# Altium schematic sheet 2_主控.SchDoc
size A3
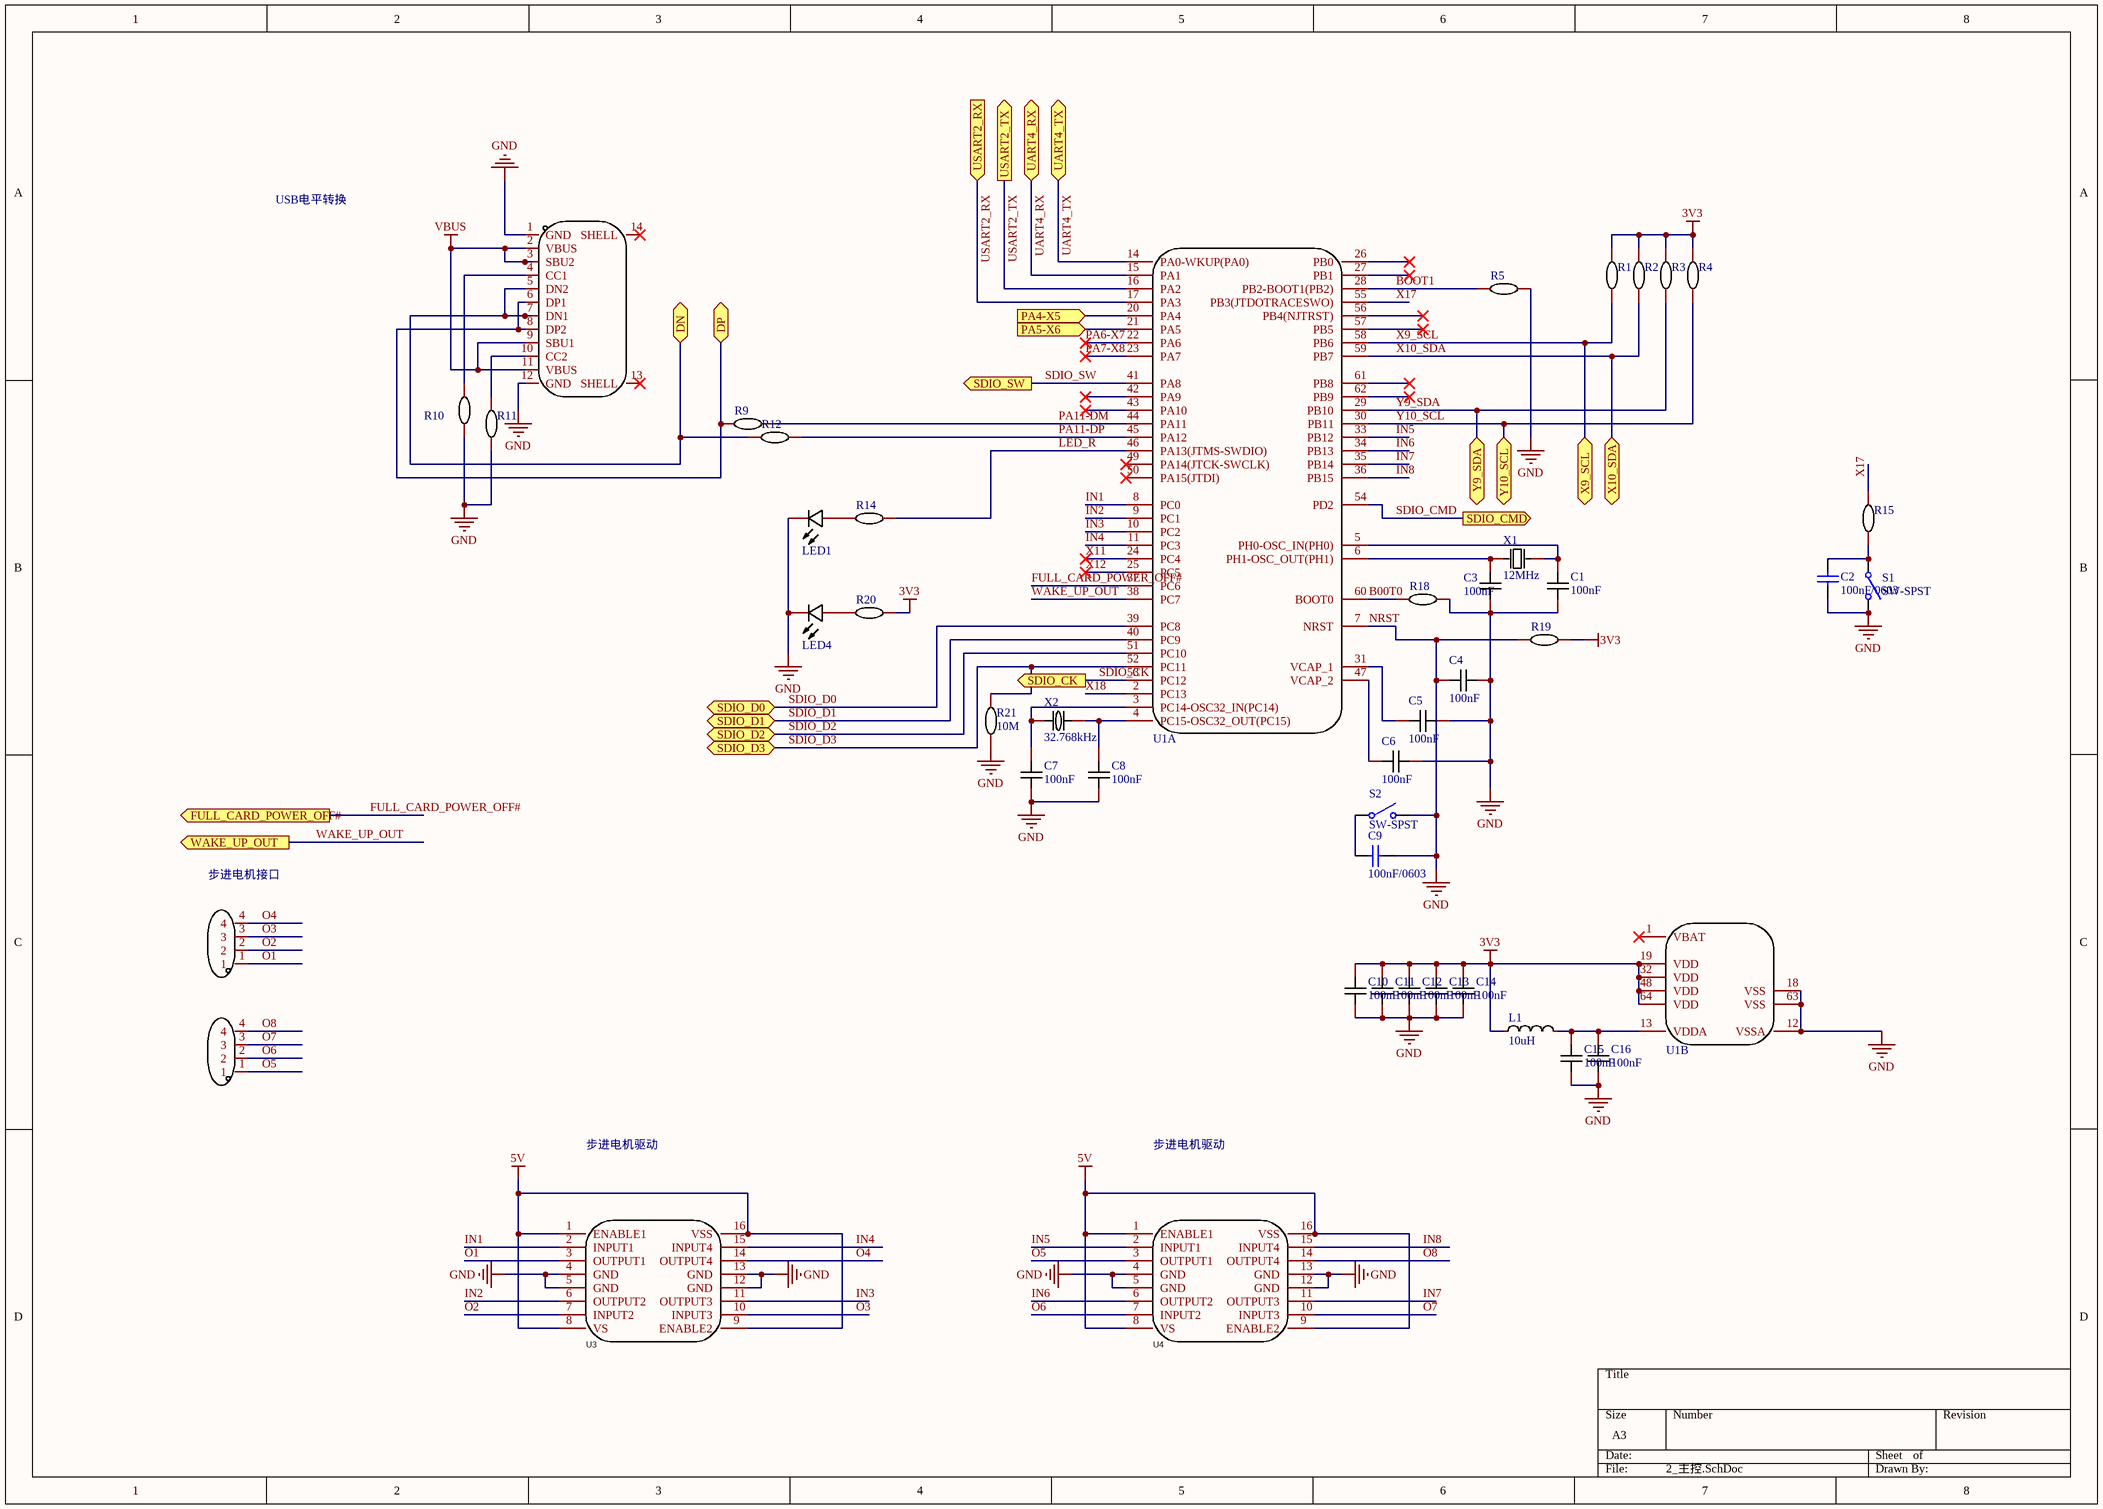
[diagram p0: 2_主控.SchDoc]

## Parts
C1  100nF  [0603C]
C2  100nF/0603  [0603C]
C3  100nF  [0603C]
C4  100nF  [0603C]
C5  100nF  [0603C]
C6  100nF  [0603C]
C7  100nF  [0603C]
C8  100nF  [0603C]
C9  100nF/0603  [0603C]
C10  100nF  [0402C]
C11  100nF  [0402C]
C12  100nF  [0402C]
C13  100nF  [0402C]
C14  100nF  [0402C]
C15  100nF  [0402C]
C16  100nF  [0402C]
CN1  HC-XHB-4A  [CONN-TH_4P-P2.50_HCTL_HC-XHB-4A]  (value not drawn)
CN2  HC-XHB-4A  [CONN-TH_4P-P2.50_HCTL_HC-XHB-4A]  (value not drawn)
L1  10uH  [L0603]
LED1  19-217/BHC-ZL1M2RY/3T  [LED0603-R-RD]  (value not drawn)
LED4  19-217/BHC-ZL1M2RY/3T  [LED0603-R-RD]  (value not drawn)
R1  (no value)  [0402R]
R2  (no value)  [0402R]
R3  (no value)  [0402R]
R4  (no value)  [0402R]
R5  (no value)  [0402R]
R9  (no value)  [0402R]
R10  (no value)  [0402R]
R11  (no value)  [0402R]
R12  (no value)  [0402R]
R14  (no value)  [0402R]
R15  (no value)  [0402R]
R18  (no value)  [0402R]
R19  (no value)  [0402R]
R20  (no value)  [0402R]
R21  10M  [0603R]
S1  SW-SPST  [SW-3x6mm-SMT]
S2  SW-SPST  [SW-3x6mm-SMT]
U1  STM32F405RGT6  [LQFP-64_L10.0-W10.0-P0.50-LS12.0-BL]  (value not drawn)  (parts A,B of 2)
U3  L293D  [SOIC-20_L13.0-W7.6-P1.27-LS10.3-BL]  (value not drawn)
U4  L293D  [SOIC-20_L13.0-W7.6-P1.27-LS10.3-BL]  (value not drawn)
USB1  TYPE-C 16PIN 2MD(073)  [USB-C-SMD_TYPE-C-6PIN-2MD-073]  (value not drawn)
X1  12MHz  [CRYSTAL-SMD_L5.0-W3.2]
X2  32.768kHz  [FC-135R_L3.2-W1.5]

## Ports
DN (bidir), DP (bidir), FULL_CARD_POWER_OFF# (out), PA4-X5 (in), PA5-X6 (in), SDIO_CK (out), SDIO_CMD (out), SDIO_D0 (bidir), SDIO_D1 (bidir), SDIO_D2 (bidir), SDIO_D3 (bidir), SDIO_SW (out), UART4_RX (bidir), UART4_TX (bidir), USART2_RX (in), USART2_TX (out), WAKE_UP_OUT (out), X9_SCL (bidir), X10_SDA (bidir), Y9_SDA (bidir), Y10_SCL (bidir)

## Nets
3V3: C10.2 C11.2 C12.2 C13.2 C14.2 L1.1 R1.2 R2.2 R3.2 R4.2 R19.1 R20.1 U1.19(VDD) U1.32(VDD) U1.48(VDD) U1.64(VDD)
5V: U3.1(ENABLE1) U3.8(VS) U3.9(ENABLE2) U3.16(VSS) U4.1(ENABLE1) U4.8(VS) U4.9(ENABLE2) U4.16(VSS)
NRST: C1.1 C2.2 C3.1 C4.1 C4.2 C5.1 C6.1 C7.1 C8.1 C9.2 C10.1 C11.1 C12.1 C13.1 C14.1 C15.1 C16.1 LED1.2(C) LED4.2(C) R5.2 R10.1 R11.1 R18.1 R19.2 R21.1 S1.2(NO) S2.2(NO) U1.7(NRST) U1.12(VSSA) U1.18(VSS) U1.63(VSS) U3.4(GND) U3.5(GND) U3.12(GND) U3.13(GND) U4.4(GND) U4.5(GND) U4.12(GND) U4.13(GND) USB1.1(GND) USB1.12(GND)  [also labelled GND]
VBUS: USB1.2(VBUS) USB1.3(SBU2) USB1.9(SBU1) USB1.11(VBUS)
B00T0: R18.2 U1.60(BOOT0)
BOOT1: R5.1 U1.28(PB2-BOOT1(PB2))
DN: R12.2 USB1.5(DN2) USB1.7(DN1) ; port DN
DP: R9.2 USB1.6(DP1) USB1.8(DP2) ; port DP
FULL_CARD_POWER_OFF#: U1.37(PC6) ; port FULL_CARD_POWER_OFF#
IN1: U1.8(PC0) U3.2(INPUT1)
IN2: U1.9(PC1) U3.6(OUTPUT2)
IN3: U1.10(PC2) U3.11(OUTPUT3)
IN4: U1.11(PC3) U3.15(INPUT4)
IN5: U1.33(PB12) U4.2(INPUT1)
IN6: U1.34(PB13) U4.6(OUTPUT2)
IN7: U1.35(PB14) U4.11(OUTPUT3)
IN8: U1.36(PB15) U4.15(INPUT4)
LED_R: R14.2 U1.46(PA13(JTMS-SWDIO))
O1: CN1.1 U3.3(OUTPUT1)
O2: CN1.2 U3.7(INPUT2)
O3: CN1.3 U3.10(INPUT3)
O4: CN1.4 U3.14(OUTPUT4)
O5: CN2.1 U4.3(OUTPUT1)
O6: CN2.2 U4.7(INPUT2)
O7: CN2.3 U4.10(INPUT3)
O8: CN2.4 U4.14(OUTPUT4)
PA4-X5: U1.20(PA4) ; port PA4-X5
PA5-X6: U1.21(PA5) ; port PA5-X6
PA6-X7: U1.22(PA6)
PA7-X8: U1.23(PA7)
PA11-DM: R9.1 U1.44(PA11)
PA11-DP: R12.1 U1.45(PA12)
SDIO_CK: U1.53(PC12) ; port SDIO_CK
SDIO_CMD: U1.54(PD2) ; port SDIO_CMD
SDIO_D0: U1.39(PC8) ; port SDIO_D0
SDIO_D1: U1.40(PC9) ; port SDIO_D1
SDIO_D2: U1.51(PC10) ; port SDIO_D2
SDIO_D3: R21.2 U1.52(PC11) ; port SDIO_D3
SDIO_SW: U1.41(PA8) ; port SDIO_SW
UART4_RX: U1.15(PA1) ; port UART4_RX
UART4_TX: U1.14(PA0-WKUP(PA0)) ; port UART4_TX
USART2_RX: U1.17(PA3) ; port USART2_RX
USART2_TX: U1.16(PA2) ; port USART2_TX
WAKE_UP_OUT: U1.38(PC7) ; port WAKE_UP_OUT
X9_SCL: R1.1 U1.58(PB6) ; port X9_SCL
X10_SDA: R2.1 U1.59(PB7) ; port X10_SDA
X11: U1.24(PC4)
X12: U1.25(PC5)
X17: R15.2 U1.55(PB3(JTDOTRACESWO))
X18: U1.2(PC13)
Y9_SDA: R3.1 U1.29(PB10) ; port Y9_SDA
Y10_SCL: R4.1 U1.30(PB11) ; port Y10_SCL
NetC1_2: C1.2 U1.5(PH0-OSC_IN(PH0)) X1.2(OSC2)
NetC2_1: C2.1 R15.1 S1.1(COMMON)
NetC3_2: C3.2 U1.6(PH1-OSC_OUT(PH1)) X1.1(OSC1)
NetC5_2: C5.2 U1.31(VCAP_1)
NetC6_2: C6.2 U1.47(VCAP_2)
NetC7_2: C7.2 U1.3(PC14-OSC32_IN(PC14)) X2.1
NetC8_2: C8.2 U1.4(PC15-OSC32_OUT(PC15)) X2.2
NetC9_1: C9.1 S2.1(COMMON)
NetC15_2: C15.2 C16.2 L1.2 U1.13(VDDA)
NetLED1_1: LED1.1(A) R14.1
NetLED4_1: LED4.1(A) R20.2
NetR10_2: R10.2 USB1.4(CC1)
NetR11_2: R11.2 USB1.10(CC2)

Not connected (* = marked no-connect by the designer): U1 1(VBAT)* 26(PB0)* 27(PB1)* 42(PA9)* 43(PA10)* 49(PA14(JTCK-SWCLK))* 50(PA15(JTDI))* 56(PB4(NJTRST))* 57(PB5)* 61(PB8)* 62(PB9)*; USB1 13(SHELL)* 14(SHELL)*

## Notes on the sheet
- USB电平转换
- (near CN1) 步进电机接口
- 步进电机驱动

## Library data of the parts
C1 C3-C8 C10-C16 = CAP_0603: Symbol: CapAcitance; Convert to PCB: yes; Device: CAP_0603; Add into BOM: yes; Supplier Footprint: 0603; Value: 100nF; Name: 100nF
C2 C9 = Cap: Capacitor; Value: 100pF; Published: 8-Jun-2000; LatestRevisionDate: 17-Jul-2002; LatestRevisionNote: Re-released for DXP Platform.; PackageReference: RAD-0.3; Publisher: Altium Limited; PackageDescription: Radial Cap, Thru-Hole; 2 Leads; 0.3 in Pin Spacing
CN1 CN2 = HC-XHB-4A: Add into BOM: yes; Pins Structure: 1x4P; Pitch: 2.5mm; Number of PINs Per Row: 4; Current Rating (Max): 3A; Symbol: HC-XHB-4A; Device: HC-XHB-4A; Supplier: LCSC; Supplier Part: C2845492; Manufacturer Part: HC-XHB-4A; JLCPCB Part Class: Extended Part; Datasheet: https://atta.szlcsc.com/upload/public/pdf/source/20230711/94C5BFB4D0A0F292EDF07DDE5BFB6378.pdf; Convert to PCB: yes; Row Spacing: -; Number of Pins: 4P; Number of Rows: 1; Reference Series: -
L1 = L_0603: Symbol: SDFL1608S100KTF; Add into BOM: yes; Device: L_0603; Supplier Footprint: L0603; Convert to PCB: yes; Value: 10uH; Name: 10uH
LED1 LED4 = 19-217/BHC-ZL1M2RY/3T: Add into BOM: yes; Luminous Intensity (IF=20mA): 11.5~28.5mcd@5mA; Dominant Wavelength / Coordinate rank: 465~475nm; Symbol: 19-217/BHC-ZL1M2RY/3T; Device: 19-217/BHC-ZL1M2RY/3T; Supplier Part: C72041; Manufacturer Part: 19-217/BHC-ZL1M2RY/3T; Supplier Footprint: 0603; JLCPCB Part Class: Basic Part; Datasheet: https://atta.szlcsc.com/upload/public/pdf/source/20170116/1484561237273.pdf; Supplier: LCSC; Convert to PCB: yes; Name: 19-217/BHC-ZL1M2RY/3T
R1-R5 R9-R12 R14 R15 R18-R20 = RC0402FR-0710KL: Add into BOM: yes; Power(Watts): 62.5mW; Overload Voltage (Max): 50V; Device: RC0402FR-0710KL; Supplier Part: C60490; Manufacturer Part: RC0402FR-0710KL; Supplier Footprint: 0402; JLCPCB Part Class: Extended Part; Datasheet: https://atta.szlcsc.com/upload/public/pdf/source/20170606/1496716515432.pdf; Supplier: LCSC; Convert to PCB: yes
R21 = Res_0603: Convert to PCB: yes; Device: Res_0603; Add into BOM: yes; Supplier Footprint: 0603; Value: 10M; Name: 10M
S1 S2 = SW-SPST: Single-Pole, Single-Throw Switch; Published: 24-Mar-1999; LatestRevisionDate: 17-Jul-2002; LatestRevisionNote: Re-released for DXP Platform.; PackageReference: SPST-2; Publisher: Altium Limited
U1 = STM32F405RGT6: Add into BOM: yes; CPU Core: ARM Cortex-M4; Maximum Frequency: 168MHz; Supply Voltage Range: 1.8V~3.6V; Program FLASH Size: 1MB; RAM Size: 192KB; GPIO Ports Number: 51; ADC (Units/Channels/bits): 1@x16ch/12bit; DAC (Units/Channels/bits): 1@x2ch/12bit; Symbol: STM32F405RGT6; Device: STM32F405RGT6; Supplier Part: C15742; Manufacturer Part: STM32F405RGT6; Supplier Footprint: LQFP-64(10x10); JLCPCB Part Class: Extended Part; Datasheet: https://atta.szlcsc.com/upload/public/pdf/source/20140724/1457707160365.pdf; Supplier: LCSC; Convert to PCB: yes; EEPROM/Data FLASH Size: -; Name: STM32F405RGT6
U3 U4 = L293D: Add into BOM: yes; Supply Voltage: 4.5V~36V; Output Current: 600mA; Symbol: L293D; Device: L293D; Supplier Part: C12340; Manufacturer Part: L293D; Supplier Footprint: DIP-16; JLCPCB Part Class: Extended Part; Datasheet: https://atta.szlcsc.com/upload/public/pdf/source/20140724/1457707157802.pdf; Supplier: LCSC; Convert to PCB: yes
USB1 = TYPE-C 16PIN 2MD(073): Add into BOM: yes; Number of Ports: 1; Number of Contacts: 16P; Current Rating - Power (Max): 5A; Symbol: TYPE-C 16PIN 2MD(073); Device: TYPE-C 16PIN 2MD(073); Supplier: LCSC; Supplier Part: C2765186; Manufacturer Part: TYPE-C 16PIN 2MD(073); JLCPCB Part Class: Extended Part; Supplier Footprint: SMD; Datasheet: https://atta.szlcsc.com/upload/public/pdf/source/20211123/39B17C16241EAC15C5E277BDA434118E.pdf; Convert to PCB: yes; Connector Type: Type-C; Standard: -
X1 = X50328MSB2GI: Add into BOM: yes; Load Capacitance: 20pF; Symbol: X50328MSB2GI; Device: X50328MSB2GI; Supplier Part: C115962; Manufacturer Part: X50328MSB2GI; Supplier Footprint: SMD5032-2P; JLCPCB Part Class: Basic Part; Datasheet: https://atta.szlcsc.com/upload/public/pdf/source/20230220/0EBFFB9D6D8CE6A211407822BBB6C516.pdf; Supplier: LCSC; Convert to PCB: yes; Value: 12MHz; Name: 12MHz
X2 = Q13FC1350000400: Add into BOM: yes; Load Capacitance: 12.5pF; Symbol: Q13FC1350000400; Device: Q13FC1350000400; Supplier Part: C32346; Manufacturer Part: Q13FC1350000400; Supplier Footprint: SMD3215-2P; JLCPCB Part Class: Basic Part; Datasheet: https://atta.szlcsc.com/upload/public/pdf/source/20190108/C32346_746D6B07EAF90824457A96480007685F.pdf; Supplier: LCSC; Convert to PCB: yes; Value: 32.768kHz; Name: 32.768kHz